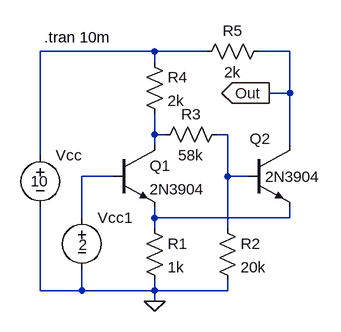
[diagram p0: schematic Schmitt.asc]
Schmitt.asc, the LTspice schematic file:
Version 4
SHEET 1 880 680
WIRE -288 224 -288 64
WIRE -288 432 -288 304
WIRE -224 320 -224 256
WIRE -224 432 -288 432
WIRE -224 432 -224 400
WIRE -176 256 -224 256
WIRE -112 64 -288 64
WIRE -112 80 -112 64
WIRE -112 192 -112 160
WIRE -112 208 -112 192
WIRE -112 320 -112 304
WIRE -112 336 -112 320
WIRE -112 432 -224 432
WIRE -112 432 -112 416
WIRE -112 448 -112 432
WIRE -96 192 -112 192
WIRE -32 64 -112 64
WIRE 0 192 -16 192
WIRE 0 256 0 192
WIRE 0 336 0 256
WIRE 0 432 -112 432
WIRE 0 432 0 416
WIRE 32 256 0 256
WIRE 96 64 48 64
WIRE 96 128 64 128
WIRE 96 128 96 64
WIRE 96 208 96 128
WIRE 96 320 -112 320
WIRE 96 320 96 304
FLAG -112 448 0
FLAG 64 128 Out
IOPIN 64 128 Out
SYMBOL voltage -288 208 R0
WINDOW 3 -15 56 Left 0
SYMATTR InstName Vcc
SYMATTR Value 10
SYMBOL npn2 -176 208 R0
SYMATTR InstName Q1
SYMATTR Value 2N3904
SYMBOL res -128 320 R0
SYMATTR InstName R1
SYMATTR Value 1k
SYMBOL npn2 32 208 R0
WINDOW 0 2 -10 Left 0
WINDOW 3 26 49 Left 0
SYMATTR InstName Q2
SYMATTR Value 2N3904
SYMBOL res -16 320 R0
SYMATTR InstName R2
SYMATTR Value 20k
SYMBOL res 0 176 R90
WINDOW 0 0 56 VBottom 0
WINDOW 3 32 56 VTop 0
SYMATTR InstName R3
SYMATTR Value 58k
SYMBOL res -128 64 R0
SYMATTR InstName R4
SYMATTR Value 2k
SYMBOL res 64 48 R90
WINDOW 0 0 56 VBottom 0
WINDOW 3 32 56 VTop 0
SYMATTR InstName R5
SYMATTR Value 2k
SYMBOL voltage -224 304 R0
WINDOW 3 -5 57 Left 0
WINDOW 123 0 0 Left 0
WINDOW 39 0 0 Left 0
SYMATTR InstName Vcc1
SYMATTR Value 2
TEXT -282 42 Left 0 !.tran 10m

The netlist it stands for:
* Schmitt.asc
Vcc N001 0 10
Q1 N003 N002 N004 0 2N3904
R1 N004 0 1k
Q2 Out N005 N004 0 2N3904
R2 N005 0 20k
R3 N005 N003 58k
R4 N001 N003 2k
R5 Out N001 2k
Vcc1 N002 0 2
.model NPN NPN
.model PNP PNP
.lib standard.bjt
.tran 10m
.backanno
.end